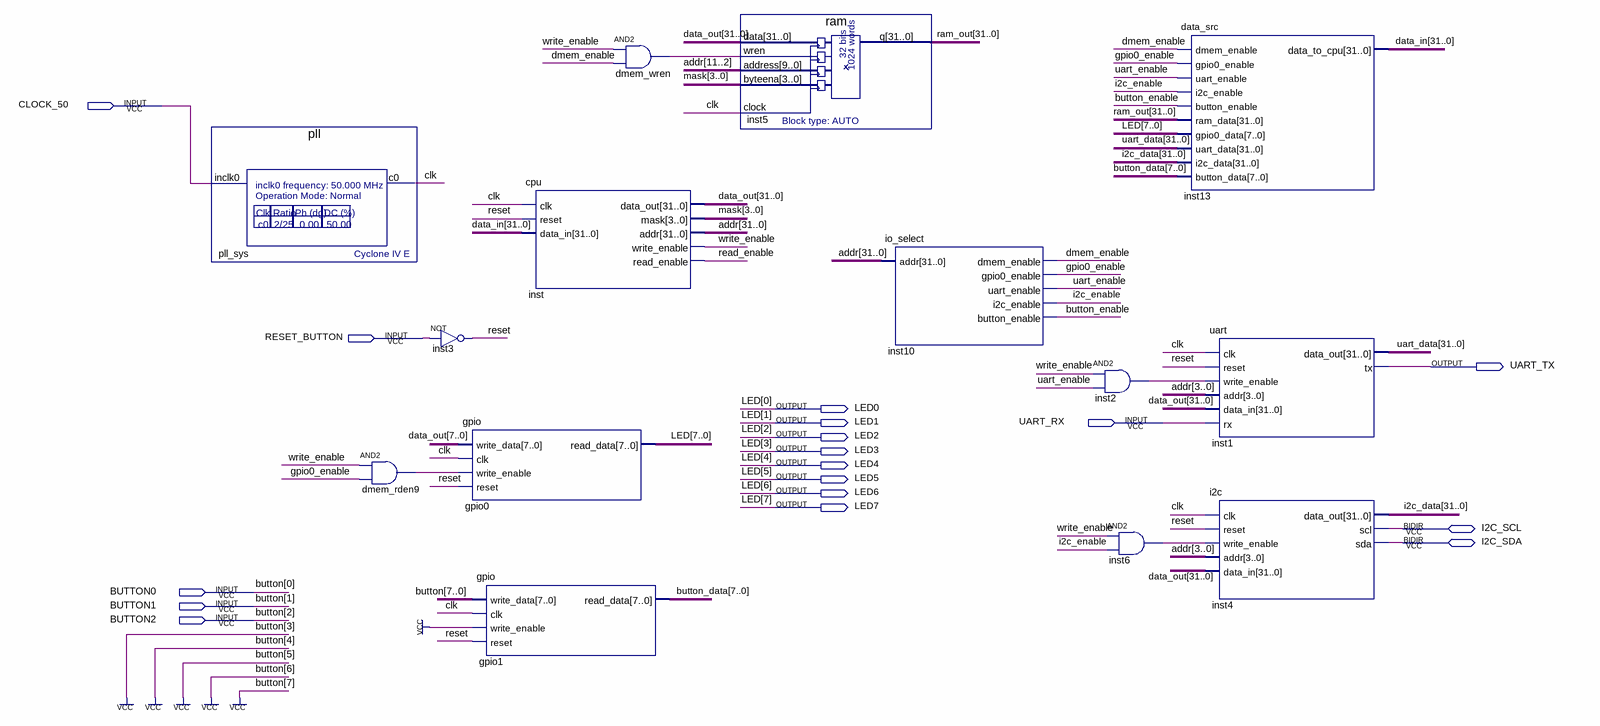
[diagram p0: schematic sheet]
// Quartus schematic rv_cpu.bdf as structural Verilog: 14 symbols, 17 pins
module rv_cpu (
  input  CLOCK_50,
  input  RESET_BUTTON,
  input  UART_RX,
  input  BUTTON0,
  input  BUTTON1,
  input  BUTTON2,
  inout  I2C_SCL,
  inout  I2C_SDA,
  output UART_TX,
  output LED0,
  output LED1,
  output LED2,
  output LED3,
  output LED4,
  output LED5,
  output LED6,
  output LED7
);

  wire button_enable, clk, dmem_enable, dmem_rden9_out, dmem_wren_out, gpio0_enable, i2c_enable, inst2_out,
       inst6_out, read_enable, reset, uart_enable, write_enable;
  wire [3:0] mask;
  wire [7:0] button_data;
  wire [31:0] addr, data_in, data_out, i2c_data, ram_out, uart_data;

  pll pll_sys (.inclk0(CLOCK_50), .c0(clk));
  and dmem_rden9 (dmem_rden9_out, write_enable, gpio0_enable);
  not inst3 (reset, RESET_BUTTON);
  gpio gpio0 (
    .write_data(data_out[7:0]), .clk(clk), .write_enable(dmem_rden9_out), .reset(reset),
    .read_data({LED7, LED6, LED5, LED4, LED3, LED2, LED1, LED0}));
  gpio gpio1 (
    .write_data({{5{1'b1}}, BUTTON2, BUTTON1, BUTTON0}), .clk(clk), .write_enable(1'b1), .reset(reset),
    .read_data(button_data));
  cpu inst (
    .clk(clk), .reset(reset), .data_in(data_in), .data_out(data_out), .mask(mask), .addr(addr),
    .write_enable(write_enable), .read_enable(read_enable));
  and dmem_wren (dmem_wren_out, write_enable, dmem_enable);
  ram inst5 (.data(data_out), .wren(dmem_wren_out), .address(addr[11:2]), .byteena(mask), .clock(clk), .q(ram_out));
  io_select inst10 (
    .addr(addr), .dmem_enable(dmem_enable), .gpio0_enable(gpio0_enable), .uart_enable(uart_enable),
    .i2c_enable(i2c_enable), .button_enable(button_enable));
  and inst2 (inst2_out, write_enable, uart_enable);
  and inst6 (inst6_out, write_enable, i2c_enable);
  data_src inst13 (
    .dmem_enable(dmem_enable), .gpio0_enable(gpio0_enable), .uart_enable(uart_enable),
    .i2c_enable(i2c_enable), .button_enable(button_enable), .ram_data(ram_out),
    .gpio0_data({LED7, LED6, LED5, LED4, LED3, LED2, LED1, LED0}), .uart_data(uart_data),
    .i2c_data(i2c_data), .button_data(button_data), .data_to_cpu(data_in));
  uart inst1 (
    .clk(clk), .reset(reset), .write_enable(inst2_out), .addr(addr[3:0]), .data_in(data_out), .rx(UART_RX),
    .data_out(uart_data), .tx(UART_TX));
  i2c inst4 (
    .clk(clk), .reset(reset), .write_enable(inst6_out), .addr(addr[3:0]), .data_in(data_out),
    .data_out(i2c_data), .scl(I2C_SCL), .sda(I2C_SDA));
endmodule
